# EAGLE design NeoPixelTrinketM0 (EAGLE 9.1.3)
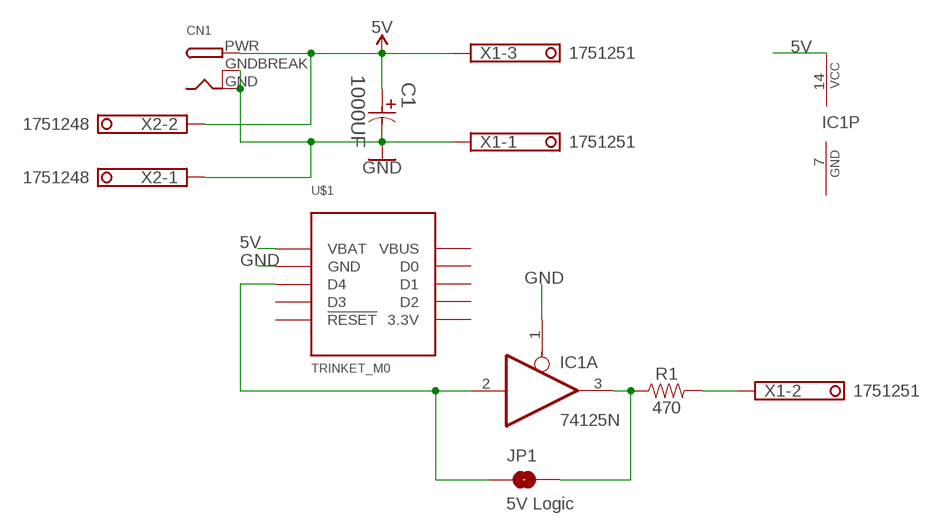
[diagram p0: schematic, sheet 1]

## Parts
C1  1000UF  ECA0JHG102-D8XP3.5  [CAPPR350-800X1150]
CN1  DCBARRELPTH  [DCJACK_2MM_PTH]
IC1  74125N  [DIL14]
JP1  5V Logic  JUMPER-SMT_2_NO_SILK_ROUND  [SMT-JUMPER_2_NO_SILK_ROUND]
R1  470  RESISTORAXIAL-0.3  [AXIAL-0.3]
U$1  TRINKET_M0  [TRINKET]
X1  1751251  [1751251]
X2  1751248  [1751248]

## Nets
5V: C1.1 CN1.PWR IC1.14(P:VCC) U$1.P$1(VBAT) X1.3 X2.2
GND: C1.2 CN1.GND CN1.GNDBREAK IC1.1(A:OE) U$1.P$2(GND) X1.1 X2.1
N$1: IC1.3(A:O) JP1.2 R1.P$1
N$2: R1.P$2 X1.2
N$3: IC1.2(A:I) JP1.1 U$1.P$3(D4)
Unconnected: IC1.4(B:OE) IC1.5(B:I) IC1.6(B:O) IC1.8(C:O) IC1.9(C:I) IC1.10(C:OE) IC1.11(D:O) IC1.12(D:I) IC1.13(D:OE) U$1.P$4(D3) U$1.P$5(!RESET) U$1.P$7(D2) U$1.P$8(D1) U$1.P$9(D0)

## Power pins joined to a net without a drawn wire
3.3V: U$1.P$6(3.3V)
GND: IC1.7(P:GND)
VBUS: U$1.P$10(VBUS)

## Library data of the parts
C1 = Panasonic-ECA_01:ECA: Aluminum Electrolytic Capacitors/Radial Lead Type; MPN: ECA0JHG102; OC_FARNELL: 9692738; OC_NEWARK: 96K9139; PACKAGE: Radial Lead-TH; SUPPLIER: PANASONIC; TOLERANCE: ±20 %; VOLTAGERATING: 6.3V
CN1 = adafruit:DCBARREL: 2.0mm DC Barrel Jack DCJACK_2MM_PTH - Through Hole Jack (4UConnector: 05537)
IC1 = adafruit:74*125: Quad bus BUFFER, 3-state
JP1 = SparkFun-Jumpers:JUMPER-SMT_2_NO: Normally open jumper This jumper has two pads in close proximity to each other. Apply solder to close the connection. Round pads are easier to solder for beginners, but are a lot larger. SparkFun Product that uses the round pads: SparkFun EL Sequencer <https://www.sparkfun.com/products/12781>
R1 = SparkFun-Resistors:RESISTOR: Generic Resistor Package
U$1 = ludwig:TRINKET_M0: Adafruit Trinket M0 (3500) ATSAMD21E18 32bit Cortex M0+ 256KB Flash 32KB Ram
X1 = con-phoenix-350:1751251: MKDS 1/ 3-3,5 Printklemme Nennstrom: 10 A Bemessungsspannung: 160 V Raster: 3,5 mm Polzahl: 3 Montageart: Löten Anschlussart: Schraubanschluss Anschlussrichtung vom Leiter zur Platine: 0° Source: http://eshop.phoenixcontact.com .. 1751251.pdf; OC_FARNELL: unknown; OC_NEWARK: unknown
X2 = con-phoenix-350:1751248: MKDS 1/ 2-3,5 Printklemme Nennstrom: 10 A Bemessungsspannung: 160 V Raster: 3,5 mm Polzahl: 2 Montageart: Löten Anschlussart: Schraubanschluss Anschlussrichtung vom Leiter zur Platine: 0° Source: http://eshop.phoenixcontact.com .. 1751248.pdf; OC_FARNELL: unknown; OC_NEWARK: unknown

## Board
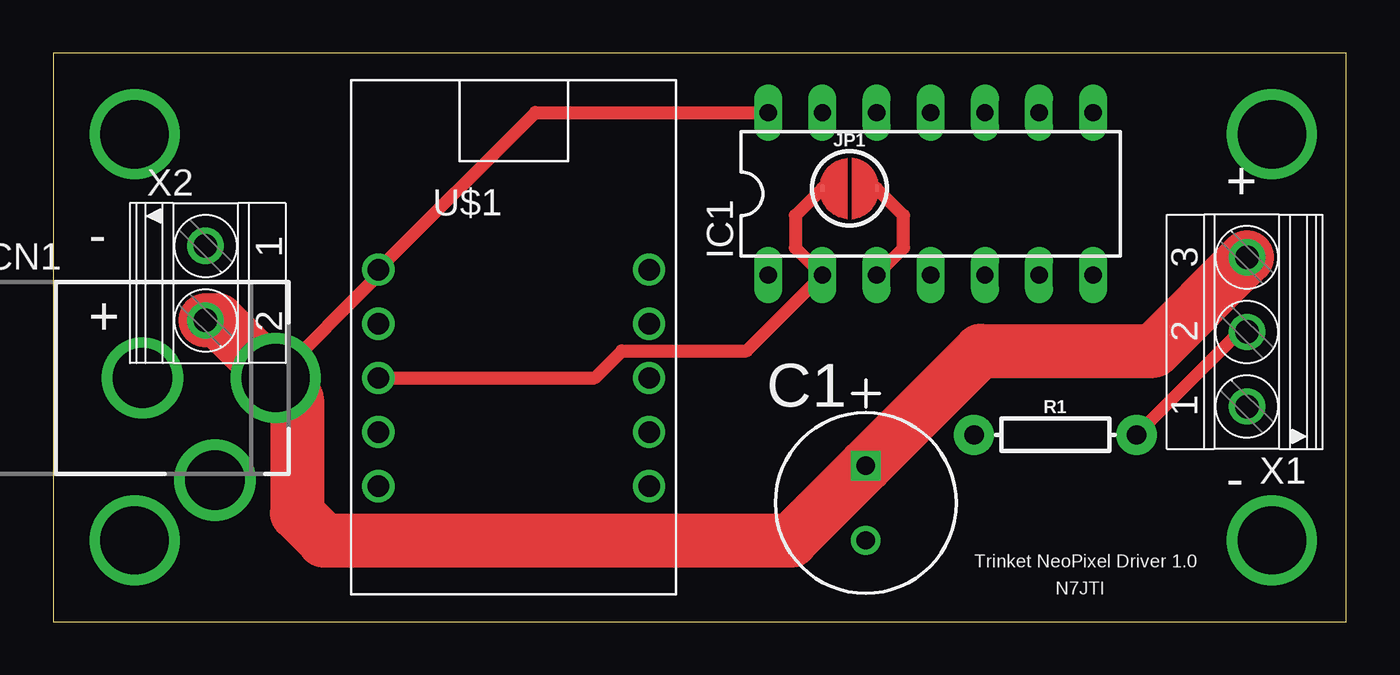
[diagram p1: board, top side]
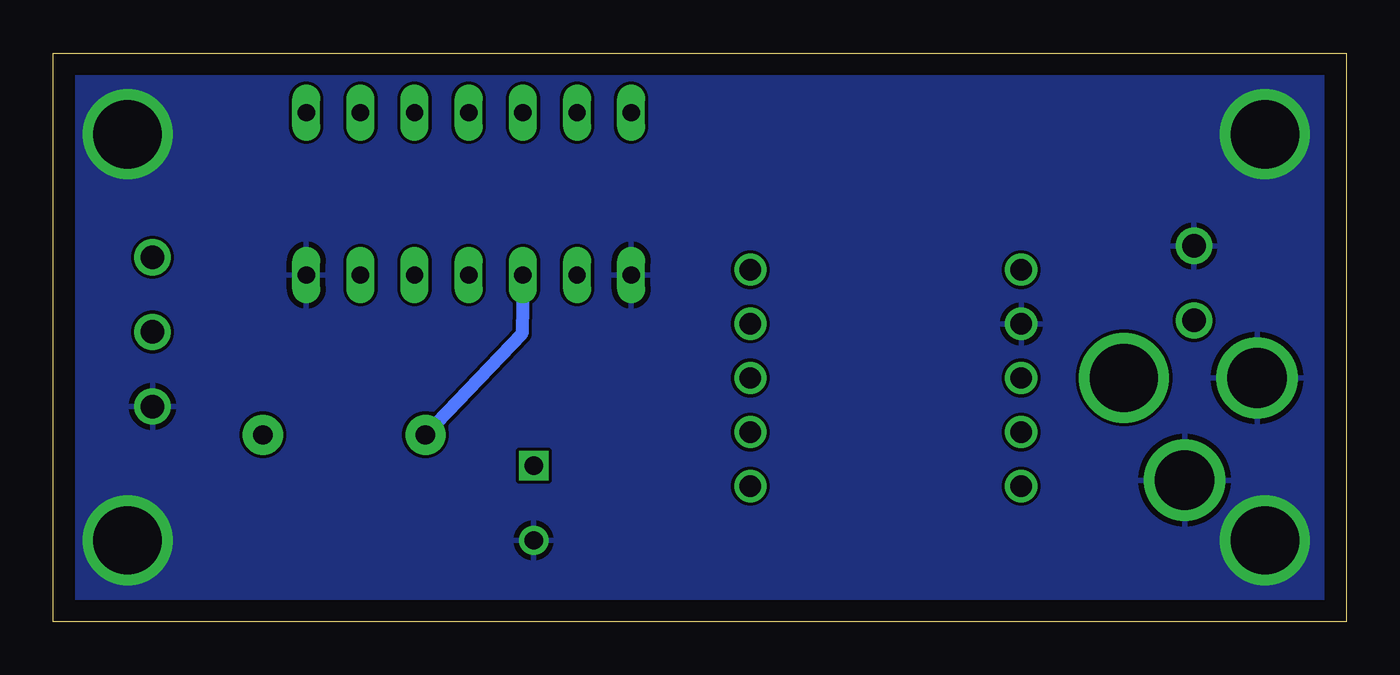
[diagram p2: board, bottom side, seen from below]

Size 60.63 x 26.66 mm. Coordinates in mm from the lower left corner, seen from the top.
Outline: 0,0 60.63,0 60.63,26.66 0,26.66 0,0
Copper layers (1*16): Top 0.035mm / dielectric 1.5mm / Bottom 0.035mm
Design rules "default": minimum track width 6mil, minimum drill 0.35mm, track to track 6mil, track to pad 6mil, pad to pad 6mil, via to via 6mil, smd to smd 6mil, copper to edge 40mil, drill to drill 6mil, minimum pad ring 10mil, minimum via ring 8mil, stop-mask expansion 4mil, vias tented up to drill 0mil, thermal gap 10mil

### Footprints (pad centres in the part's own frame; a part is rotated, then mirrored left to right if it is on the bottom)
CAPPR350-800X1150 = drill 0.864 square: 1 -3.505,0 | drill 0.864: 2 0,0
DCJACK_2MM_PTH = drill 2.8: GND 0,7.35; GNDBREAK 4.8,10.75 | drill 3.2: PWR 0,13.6
DIL14 = drill 0.813 long: 1 -7.62,-3.81; 2 -5.08,-3.81; 3 -2.54,-3.81; 4 0,-3.81; 5 2.54,-3.81; 6 5.08,-3.81; 7 7.62,-3.81; 8 7.62,3.81; 9 5.08,3.81; 10 2.54,3.81; 11 0,3.81; 12 -2.54,3.81; 13 -5.08,3.81; 14 -7.62,3.81
SMT-JUMPER_2_NO_SILK_ROUND = smd 0.152 x 0.305: 1 -1.27,0; 2 1.27,0
AXIAL-0.3 = drill 0.9 pad 1.88: P$1 -3.81,0; P$2 3.81,0
TRINKET = drill 1: P$1 0,10.16; P$2 0,7.62; P$3 0,5.08; P$4 0,2.54; P$5 0,0; P$6 12.7,0; P$7 12.7,2.54; P$8 12.7,5.08; P$9 12.7,7.62; P$10 12.7,10.16
1751251 = drill 1.1 pad 1.7: 1 -3.5,-0.1; 2 0,-0.1; 3 3.5,-0.1
1751248 = drill 1.1 pad 1.7: 1 -1.75,-0.1; 2 1.75,-0.1

### Placement (x,y rotation side)
C1  38.1,3.81 270 top
CN1  -3.17,11.43 270 top
IC1  41.15,20.07 0 top
JP1  37.34,20.32 0 top
R1  46.99,8.76 0 top
U$1  15.24,6.35 0 top
X1  55.88,13.59 90 top
X2  7.24,15.88 270 top

### Tracks (layer width: path | path; a pad name or v marks a point on that pad's centre or on a via)
5V
  Top 0.61: CN1.PWR 15.24,16.25 U$1.P$1 22.61,23.88 IC1.14
  Top 2.54: X1.3 51.59,12.7 43.48,12.7 C1.1 34.59,3.81 12.7,3.81 11.43,5.08 11.43,10.43 CN1.PWR 7.73,14.12 X2.2
GND  (via drill 3.2)
  other vias: 3.81,22.86 3.81,3.81 57.15,22.86 57.15,3.81
  pour Bottom: 0.25,26.42 60.45,26.42 60.45,0.13 0.38,0.13 0.25,0.25 0.25,22.61
N$1
  Top 0.61: IC1.3 39.88,17.53 39.88,19.05 JP1.2
  Bottom 0.61: IC1.3 38.65,13.5 R1.P$1
N$2
  Top 0.61: R1.P$2 55.63,13.59 X1.2
N$3
  Top 0.61: U$1.P$3 25.4,11.43 26.67,12.7 29.21,12.7 32.51,12.7 IC1.2 34.8,17.53 34.8,19.05 JP1.1

### Text on the board
tPlace: + | - | + | - | Trinket NeoPixel Driver 1.0 | N7JTI